# Altium schematic sheet Sheet_3.schdoc
size 300 x 143 mm
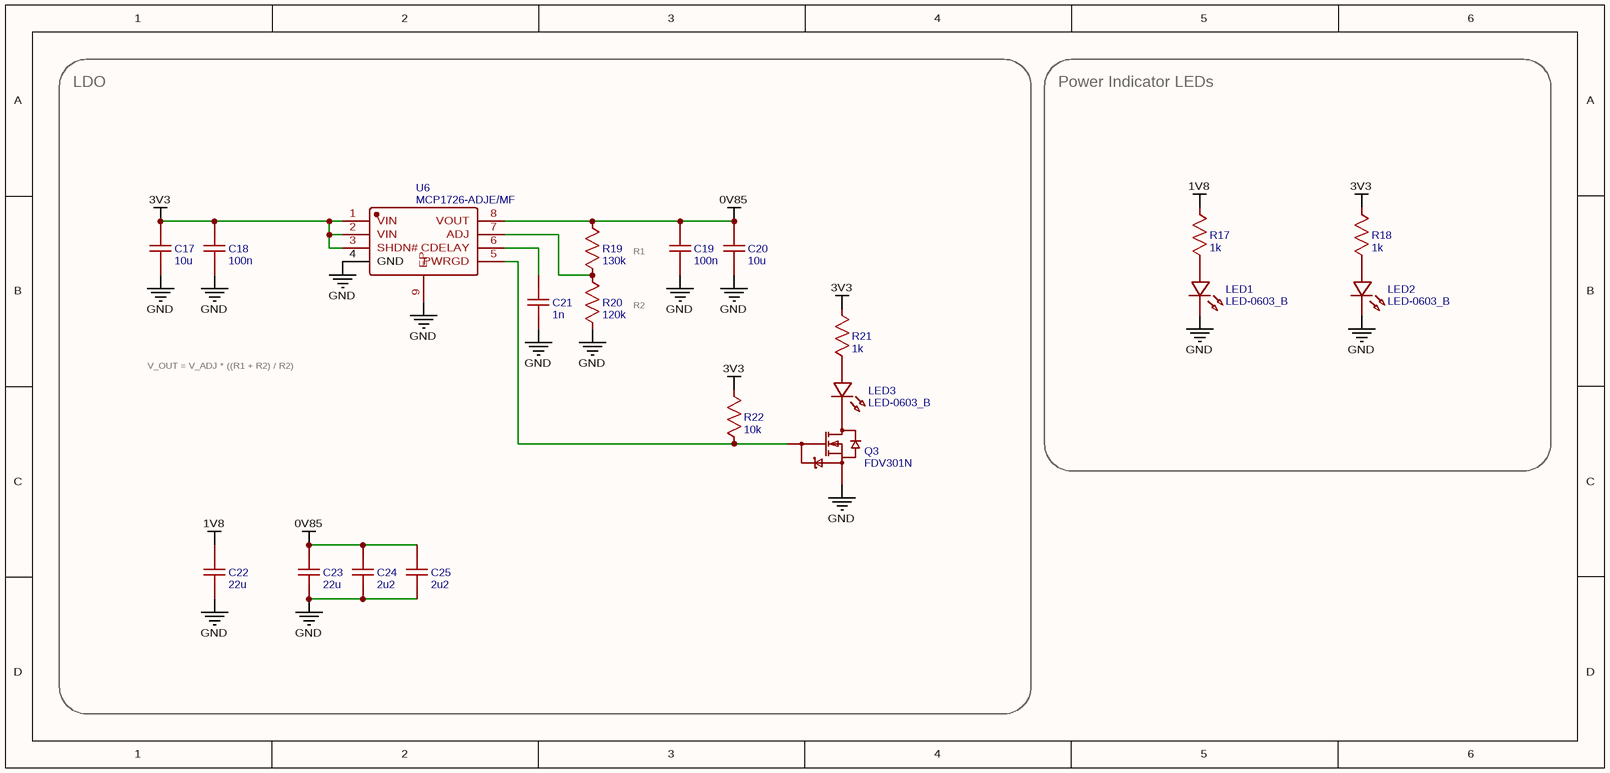
[diagram p0: Sheet_3.schdoc]

## Parts
C17  10u  [CAPA-0402]
C18  100n  [CAPA-0402]
C19  100n  [CAPA-0402]
C20  10u  [CAPA-0402]
C21  1n  [CAPA-0402]
C22  22u  [CAPA-1206]
C23  22u  [CAPA-1206]
C24  2u2  [CAPA-1206]
C25  2u2  [CAPA-1206]
LED1  LED-0603_B  [LED-0603]
LED2  LED-0603_B  [LED-0603]
LED3  LED-0603_B  [LED-0603]
Q3  FDV301N  [SOT-23_L2.9-W1.3-P1.90-LS2.4-BR]
R17  1k  [RES-0402]
R18  1k  [RES-0402]
R19  130k  [RES-0402]
R20  120k  [RES-0402]
R21  1k  [RES-0402]
R22  10k  [RES-0402]
U6  MCP1726-ADJE/MF  [TDFN-8_L3.0-W3.0-P0.65-BL-EP]

## Blocks framed on the sheet
LDO: C17-C25 LED3 Q3 R19-R22 U6
Power Indicator LEDs: LED1 LED2 R17 R18

## Nets
0V85: C19.2 C20.2 C23.2 C24.2 C25.2 R19.2 U6.8(VOUT)
1V8: C22.2 R17.2
3V3: C17.2 C18.2 R18.2 R21.2 R22.2 U6.1(VIN) U6.2(VIN) U6.3(SHDN#)
GND: C17.1 C18.1 C19.1 C20.1 C21.1 C22.1 C23.1 C24.1 C25.1 LED1.2 LED2.2 Q3.2(S) R20.1 U6.4(GND) U6.9(EP)
NetC21_2: C21.2 U6.6(CDELAY)
NetLED1_1: LED1.1 R17.1
NetLED2_1: LED2.1 R18.1
NetLED3_1: LED3.1 R21.1
NetLED3_2: LED3.2 Q3.3(D)
NetQ3_1: Q3.1(G) R22.1 U6.5(PWRGD)
NetR19_1: R19.1 R20.2 U6.7(ADJ)

## Notes on the sheet
- R1
- R2
- V_OUT = V_ADJ * ((R1 + R2) / R2)

## Library data of the parts
C17 C20 = 10u: BOM_Manufacturer Part: JMK105CBJ106MV-F; BOM_Manufacturer: TAIYO YUDEN; nameAlias: Value(F); BOM_Supplier Part: C87148; BOM_Supplier: LCSC; link: https://atta.szlcsc.com//upload/public/pdf/source/20161110/1478747663421.pdf; spicePre: C; spiceSymbolName: CAPA-0402_10u
C18 C19 = 100n: BOM_Manufacturer Part: CL05B104KB54PNC; BOM_Manufacturer: SAMSUNG; nameAlias: Value(F); BOM_Supplier Part: C307331; BOM_Supplier: LCSC; link: https://atta.szlcsc.com//upload/public/pdf/source/20160103/1457707735223.pdf; spicePre: C; spiceSymbolName: CAPA-0402_100n
C21 = 1n: BOM_Manufacturer Part: CC0402JRNPO9BN102; BOM_Manufacturer: YAGEO 国巨; nameAlias: Value(F); BOM_Supplier Part: C113780; BOM_Supplier: LCSC; link: https://atta.szlcsc.com//upload/public/pdf/source/20170602/1496384427106.pdf; spicePre: C; spiceSymbolName: CAPA-0402_1n
C22 C23 = 22u: BOM_Manufacturer Part: CL31A226KAHNNNE; BOM_Manufacturer: SAMSUNG; nameAlias: Value(F); BOM_Supplier Part: C12891; BOM_Supplier: LCSC; link: https://atta.szlcsc.com/upload/public/pdf/source/20170325/1490427913016.pdf; spicePre: C; spiceSymbolName: CAPA-1206_22u_25V
C24 C25 = 2u2: BOM_Manufacturer Part: CL31B225KBHNNNE; BOM_Manufacturer: SAMSUNG; nameAlias: Value(F); BOM_Supplier Part: C50254; BOM_Supplier: LCSC; link: https://atta.szlcsc.com/upload/public/pdf/source/20170325/1490427913016.pdf; spicePre: C; spiceSymbolName: CAPA-1206_2u2_50V
LED1-LED3 = LED-0603_B: BOM_Manufacturer: KENTO; BOM_Manufacturer Part: XL-0603QBC; BOM_Supplier Part: C2288; BOM_Supplier: LCSC; link: https://atta.szlcsc.com//upload/public/pdf/source/20150713/1457707325118.pdf; spicePre: L; spiceSymbolName: LED-0603_B
Q3 = FDV301N: BOM_Manufacturer: onsemi(安森美); BOM_Supplier: LCSC; BOM_Manufacturer Part: FDV301N; BOM_Supplier Part: C15310; BOM_JLCPCB Part Class: Extended Part; spicePre: Q; spiceSymbolName: FDV301N
R17 R18 R21 = 1k: BOM_Manufacturer Part: 0402WGF1001TCE; BOM_Manufacturer: UniOhm 台湾厚声; nameAlias: Value(Ω); BOM_Supplier Part: C11702; BOM_Supplier: LCSC; link: https://atta.szlcsc.com//upload/public/pdf/source/20200306/C422600_1E6D84923E4A46A82E41ADD87F860B5C.pdf; spicePre: R; spiceSymbolName: RES-0402_1k
R19 = 130k: BOM_Manufacturer Part: 0402WGF1303TCE; BOM_Manufacturer: UniOhm 台湾厚声; nameAlias: Value(Ω); BOM_Supplier Part: C52929; BOM_Supplier: LCSC; link: https://atta.szlcsc.com//upload/public/pdf/source/20200306/C422600_1E6D84923E4A46A82E41ADD87F860B5C.pdf; spicePre: R; spiceSymbolName: RES-0402_130k
R20 = 120k: BOM_Manufacturer Part: 0402WGF1203TCE; BOM_Manufacturer: UniOhm 台湾厚声; nameAlias: Value(Ω); BOM_Supplier Part: C25750; BOM_Supplier: LCSC; link: https://atta.szlcsc.com//upload/public/pdf/source/20200306/C422600_1E6D84923E4A46A82E41ADD87F860B5C.pdf; spicePre: R; spiceSymbolName: RES-0402_120k
R22 = 10k: BOM_Manufacturer Part: 0402WGF1002TCE; BOM_Manufacturer: UniOhm 台湾厚声; nameAlias: Value(Ω); BOM_Supplier Part: C25744; BOM_Supplier: LCSC; link: https://atta.szlcsc.com//upload/public/pdf/source/20200306/C422600_1E6D84923E4A46A82E41ADD87F860B5C.pdf; spicePre: R; spiceSymbolName: RES-0402_10k
U6 = MCP1726-ADJE/MF: BOM_Manufacturer: MICROCHIP(美国微芯); BOM_Supplier: LCSC; BOM_Supplier Part: C184287; BOM_Manufacturer Part: MCP1726-ADJE/MF; BOM_JLCPCB Part Class: Extended Part; link: https://ww1.microchip.com/downloads/aemDocuments/documents/APID/ProductDocuments/DataSheets/1A-Low-Voltage-Low-Quiescent-Current-LDO-Regulator-DS20001936E.pdf; spicePre: U; spiceSymbolName: MCP1726-ADJE/MF